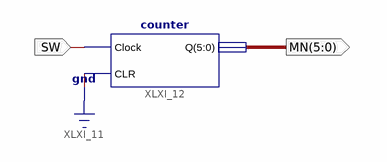
[diagram p0: schematic sheet 1]
// Xilinx ISE schematic main.sch (spartan6) as structural Verilog: 1 symbols, 2 ports
module main (
  input  SW,
  output [5:0] MN
);

  counter XLXI_12 (.Clock(SW), .CLR(1'b0), .Q(MN));
endmodule
